# EAGLE schematic PVTracker (EAGLE 5.09)
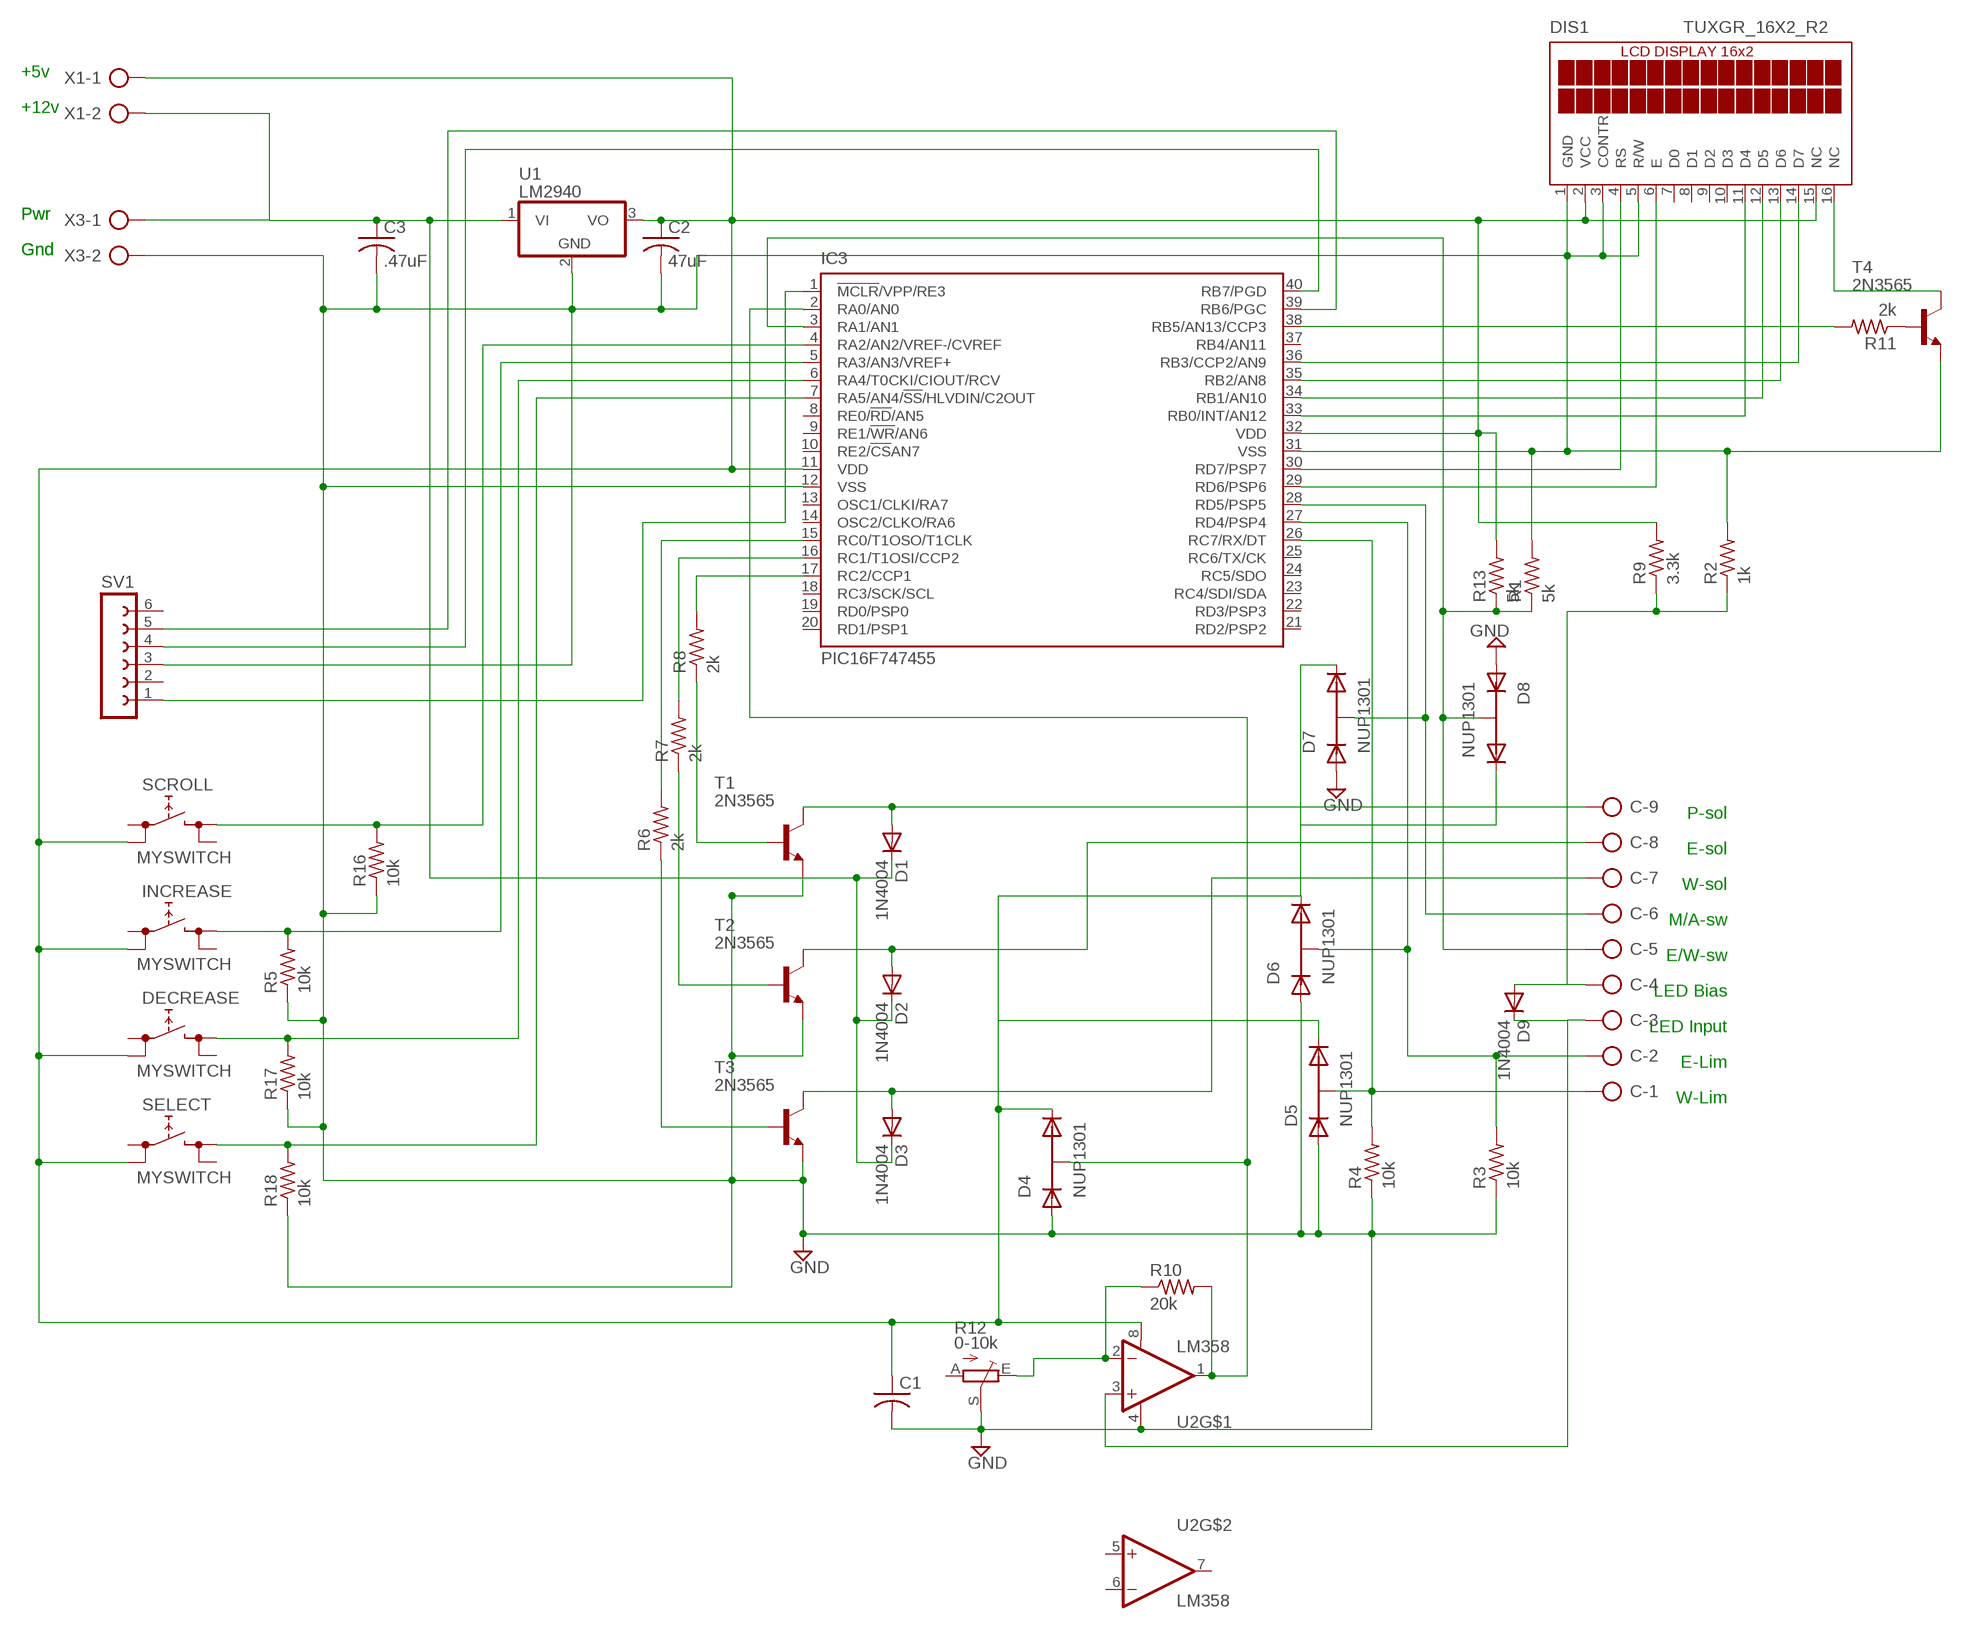
[diagram p0: schematic, sheet 1]

## Parts
C  AK300/9  [AK300/9]
C1  C-US025-030X050  [C025-030X050]
C2  47uF  C-US025-030X050  [C025-030X050]
C3  .47uF  C-USC0805  [C0805]
D1  1N4004  [DO41-10]
D2  1N4004  [DO41-10]
D3  1N4004  [DO41-10]
D4  NUP1301  [SOT-23]
D5  NUP1301  [SOT-23]
D6  NUP1301  [SOT-23]
D7  NUP1301  [SOT-23]
D8  NUP1301  [SOT-23]
D9  1N4004  [DO41-10]
DECREASE  MYSWITCH  [MYSWITCH]
DIS1  TUXGR_16X2_R2  [TUXGR_16X2_R2]
IC3  PIC16F747455  [DIL40]
INCREASE  MYSWITCH  [MYSWITCH]
R1  5k  R-US_R0805  [R0805]
R2  1k  R-US_R0805  [R0805]
R3  10k  R-US_R0805  [R0805]
R4  10k  R-US_R0805  [R0805]
R5  10k  R-US_R0805  [R0805]
R6  2k  R-US_R0805  [R0805]
R7  2k  R-US_R0805  [R0805]
R8  2k  R-US_R0805  [R0805]
R9  3.3k  R-US_R0805  [R0805]
R10  20k  R-US_R0805  [R0805]
R11  2k  R-US_R0805  [R0805]
R12  0-10k  TRIM_EU-CA6V  [CA6V]
R13  5k  R-US_R0805  [R0805]
R16  10k  R-US_R0805  [R0805]
R17  10k  R-US_R0805  [R0805]
R18  10k  R-US_R0805  [R0805]
SCROLL  MYSWITCH  [MYSWITCH]
SELECT  MYSWITCH  [MYSWITCH]
SV1  FE06-1  [FE06]
T1  2N3565  [TO92]
T2  2N3565  [TO92]
T3  2N3565  [TO92]
T4  2N3565  [TO92]
U1  LM2940  [SOT-223]
U2  LM358  [DIP08]
X1  AK300/2  [AK300/2]
X3  AK300/2  [AK300/2]

## Nets
GND: C1.2 C2.2 C3.2 D4.1 D5.1 D6.1 D7.1 D8.1 DIS1.1(GND) DIS1.3(CONTR) DIS1.5(R/W) IC3.12(VSS) IC3.31(VSS) R1.2 R2.2 R3.1 R4.1 R5.1 R12.S R16.1 R17.1 R18.1 SV1.3 T1.3(E) T2.3(E) T3.3(E) T4.3(E) U1.2(GND) U2.4(V-) X3.2
N$1: C1.1 C2.1 D4.2 D5.2 D6.2 D7.2 D8.2 DECREASE.A0 DIS1.2(VCC) DIS1.15(NC) IC3.11(VDD) IC3.32(VDD) INCREASE.A0 R9.2 R13.2 SCROLL.A0 SELECT.A0 U1.3(VO) U2.8(V+) X1.1
N$2: C.5 D8.3 IC3.3(RA1/AN1) R1.1 R13.1
N$3: DIS1.4(RS) IC3.30(RD7/PSP7)
N$4: DIS1.6(E) IC3.29(RD6/PSP6)
N$5: DIS1.11(D4) IC3.33(RB0/INT/AN12)
N$6: DIS1.12(D5) IC3.34(RB1/AN10)
N$7: DIS1.13(D6) IC3.35(RB2/AN8)
N$8: DIS1.14(D7) IC3.36(RB3/CCP2/AN9)
N$9: IC3.15(RC0/T1OSO/T1CLK) R6.2
N$10: IC3.16(RC1/T1OSI/CCP2) R7.2
N$11: IC3.17(RC2/CCP1) R8.2
N$12: C.9 D1.A T1.1(C)
N$13: C.8 D2.A T2.1(C)
N$14: C.7 D3.A T3.1(C)
N$15: C3.1 D1.C D2.C D3.C U1.1(VI) X1.2 X3.1
N$16: IC3.1(!MCLR!/VPP/RE3) SV1.1
N$17: C.2 D6.3 IC3.27(RD4/PSP4) R3.2
N$18: IC3.40(RB7/PGD) SV1.4
N$19: IC3.39(RB6/PGC) SV1.5
N$20: R11.1 T4.2(B)
N$21: C.6 D7.3 IC3.28(RD5/PSP5)
N$22: C.4 D9.A R2.1 R9.1
N$23: C.3 D9.C U2.3(+IN)
N$24: C.1 D5.3 IC3.26(RC7/RX/DT) R4.2
N$25: DIS1.16(NC) T4.1(C)
N$26: IC3.4(RA2/AN2/VREF-/CVREF) R16.2 SCROLL.B0
N$27: IC3.5(RA3/AN3/VREF+) INCREASE.B0 R5.2
N$28: DECREASE.B0 IC3.6(RA4/T0CKI/CIOUT/RCV) R17.2
N$29: IC3.7(RA5/AN4/!SS!/HLVDIN/C2OUT) R18.2 SELECT.B0
N$30: R8.1 T1.2(B)
N$31: D4.3 IC3.2(RA0/AN0) R10.2 U2.1(OUT)
N$32: R10.1 R12.E U2.2(-IN)
N$33: R7.1 T2.2(B)
N$34: R6.1 T3.2(B)
N$35: IC3.38(RB5/AN13/CCP3) R11.2
Unconnected: DECREASE.A1 DECREASE.B1 DIS1.7(D0) DIS1.8(D1) DIS1.9(D2) DIS1.10(D3) IC3.8(RE0/!RD!/AN5) IC3.9(RE1/!WR!/AN6) IC3.10(RE2/!CS!AN7) IC3.13(OSC1/CLKI/RA7) IC3.14(OSC2/CLKO/RA6) IC3.18(RC3/SCK/SCL) IC3.19(RD0/PSP0) IC3.20(RD1/PSP1) IC3.21(RD2/PSP2) IC3.22(RD3/PSP3) IC3.23(RC4/SDI/SDA) IC3.24(RC5/SDO) IC3.25(RC6/TX/CK) IC3.37(RB4/AN11) INCREASE.A1 INCREASE.B1 R12.A SCROLL.A1 SCROLL.B1 SELECT.A1 SELECT.B1 SV1.2 SV1.6 U2.5(+IN) U2.6(-IN) U2.7(OUT)

## Notes on the sheet
- +5v
- +12v
- Pwr | Pwr
- Gnd | Gnd
- P-sol
- E-sol
- W-sol
- M/A-sw
- E/W-sw
- LED Bias
- LED Input
- E-Lim
- W-Lim

## Library data of the parts
C = con-ptr500:AK300/9: CONNECTOR
C1 C2 = resistor:C-US: CAPACITOR, American symbol
C3 = rcl:C-US: CAPACITOR, American symbol
D1-D3 D9 = diode:1N4004: DIODE general purpose rectifier, 1 A
D4-D8 = custom_Elijah:NUP1301
DECREASE INCREASE SCROLL SELECT = switch:MYSWITCH
DIS1 = display-lcd:TUXGR_16X2_R2: Tuxgraphics LCD display 16x2 characters reflective, without background light Source: tuxgr_12x2_r2.pdf
IC3 = PIC16F747:PIC16F747: USB Microcontrollers with nanoWatt Technology High-Performance, Enhanced Flash, 28/40/44-Pin, Source: http://ww1.microchip.com/downloads/en/devicedoc/39632c.pdf
R1-R11 R13 R16-R18 = rcl:R-US_: RESISTOR, American symbol
R12 = pot:TRIM_EU-: POTENTIOMETER
SV1 = con-lsta:FE06-1: FEMALE HEADER
T1-T4 = transistor:2N3565: NPN TRANSISTOR
U1 = custom_Elijah:LM2940
U2 = SparkFun:LM358
X1 X3 = con-ptr500:AK300/2: CONNECTOR